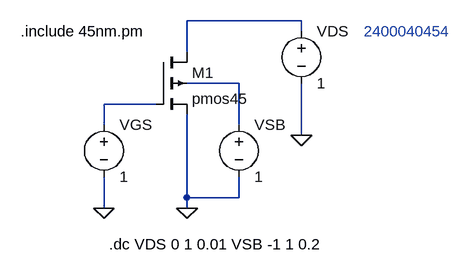
[diagram p0: schematic Pmos45.asc]
Pmos45.asc, the LTspice schematic file:
Version 4.1
SHEET 1 880 680
WIRE 384 32 208 32
WIRE 384 48 384 32
WIRE 208 80 208 32
WIRE 288 128 208 128
WIRE 160 160 80 160
WIRE 80 192 80 160
WIRE 288 192 288 128
WIRE 384 208 384 128
WIRE 208 304 208 176
WIRE 288 304 288 272
WIRE 288 304 208 304
WIRE 80 320 80 272
WIRE 208 320 208 304
FLAG 80 320 0
FLAG 208 320 0
FLAG 384 208 0
SYMBOL pmos4 160 80 R0
SYMATTR InstName M1
SYMATTR Value pmos45
SYMATTR Value2 l=45nm w=1u
SYMBOL voltage 80 176 R0
WINDOW 123 0 0 Left 0
WINDOW 39 0 0 Left 0
SYMATTR InstName VGS
SYMATTR Value 1
SYMBOL voltage 288 176 R0
WINDOW 123 0 0 Left 0
WINDOW 39 0 0 Left 0
SYMATTR InstName VSB
SYMATTR Value 1
SYMBOL voltage 384 32 R0
WINDOW 123 0 0 Left 0
WINDOW 39 0 0 Left 0
SYMATTR InstName VDS
SYMATTR Value 1
TEXT -48 48 Left 2 !.include 45nm.pm
TEXT 88 376 Left 2 !.dc VDS 0 1 0.01 VSB -1 1 0.2
TEXT 480 48 Left 2 ;2400040454

The netlist it stands for:
* Pmos45.asc
M1 N001 N003 0 N002 pmos45 l=45nm w=1u
VGS N003 0 1
VSB N002 0 1
VDS N001 0 1
.model NMOS NMOS
.model PMOS PMOS
.lib standard.mos
.include 45nm.pm
.dc VDS 0 1 0.01 VSB -1 1 0.2
* 2400040454
.backanno
.end